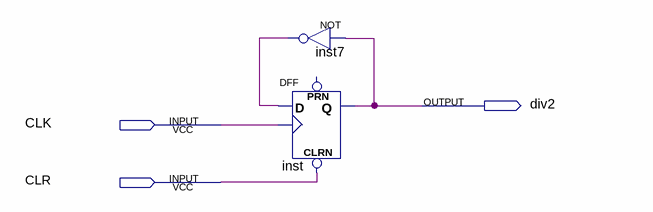
[diagram p0: schematic sheet]
// Quartus schematic div2.bdf as structural Verilog: 2 symbols, 3 pins
module div2 (
  input  CLK,
  input  CLR,
  output div2
);

  wire inst7_out;

  not inst7 (inst7_out, div2);
  DFF inst (.CLRN(CLR), .CLK(CLK), .D(inst7_out), .Q(div2));  // open: PRN
endmodule
